# EAGLE design untitled (EAGLE 7.6.0)
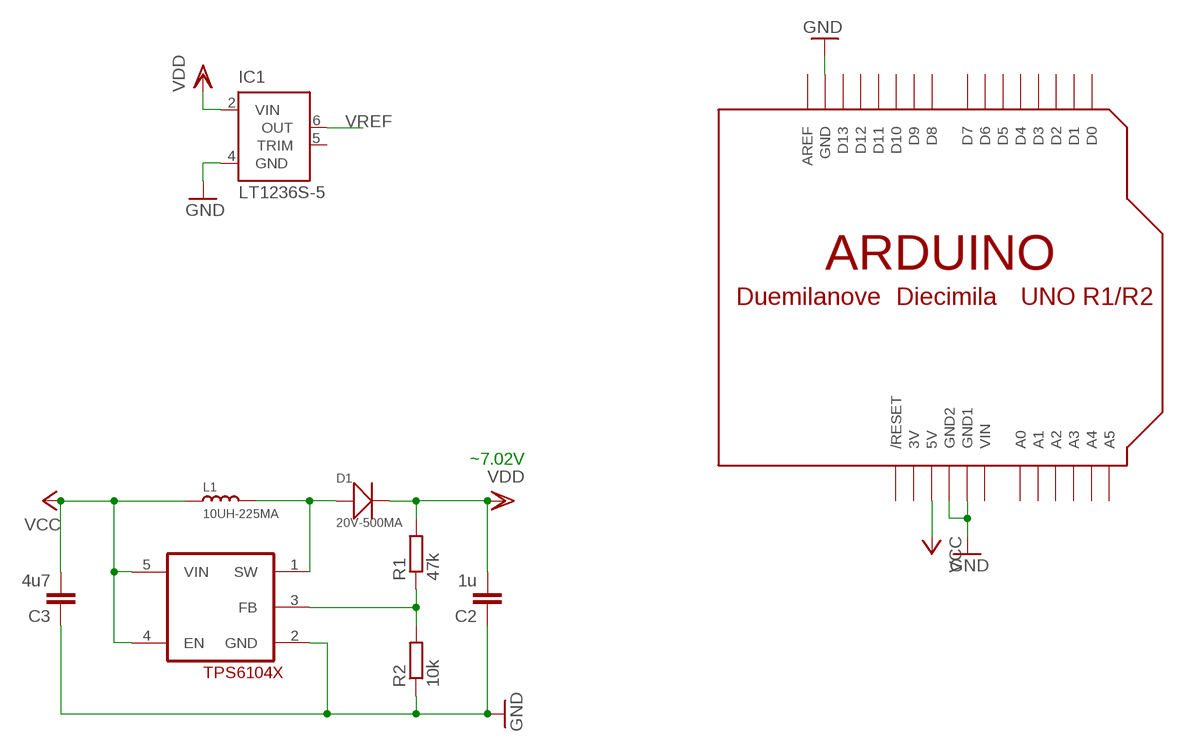
[diagram p0: schematic, sheet 1]

## Parts
C2  1u  C-EUC1206  [C1206]
C3  4u7  C-EUC1206  [C1206]
D1  20V-500MA  SMD-DIODE-SCHOTTKY-20V-500MA(SOD-123)P  [SOD-123]
IC1  LT1236S-5  [SOIC8]
L1  10UH-225MA  SMD-INDUCTOR-10UH-225MA-10%(0806)  [L0806]
R1  47k  R-EU_R0805  [R0805]
R2  10k  R-EU_R0805  [R0805]
U$1  ARDUINO-NOHOLE  [ARDUINO-NOHOLE]
U$2  TPS6104X  [SOT23-DBV]

## Nets
GND: C2.1 C3.1 IC1.4(GND) R2.1 U$1.GND U$1.GND1 U$1.GND2 U$2.2(GND)
N$1: D1.+ L1.2 U$2.1(SW)
N$5: R1.1 R2.2 U$2.3(FB)
VCC: C3.2 L1.1 U$1.5V U$2.4(EN) U$2.5(VIN)
VDD: C2.2 D1.- IC1.2(VIN) R1.2
VREF: IC1.6(OUT)
Unconnected: IC1.5(TRIM) U$1.A0 U$1.A1 U$1.A2 U$1.A3 U$1.A4 U$1.A5 U$1.AREF U$1.D0 U$1.D1 U$1.D2 U$1.D3 U$1.D4 U$1.D5 U$1.D6 U$1.D7 U$1.D8 U$1.D9 U$1.D10 U$1.D11 U$1.D12 U$1.D13 U$1.RESET(/RESET)

## Notes on the sheet
- ~7.02V

## Power pins joined to a net without a drawn wire
3V: U$1.3V
VIN: U$1.VIN

## Library data of the parts
C2 C3 = rcl:C-EU: CAPACITOR, European symbol
D1 = Seeed-Diode-2016:SMD-DIODE-SCHOTTKY-20V-500MA(SOD-123)P: 304020028; MPN: MBR0520LT1G
IC1 = linear-technology:LT1236?*: Precision Voltage Reference Source: http://www.linear.com/pc/downloadDocument.do?navId=H0,C1,C1154,C1002,C1243,P1156,D2948; OC_FARNELL: unknown; OC_NEWARK: unknown
L1 = Seeed-Inductor-2016:SMD-INDUCTOR-10UH-225MA-10%(0806): 303010042; MPN: LQH2MCN100K02L
R1 R2 = rcl:R-EU_: RESISTOR, European symbol
U$1 = adafruit:ARDUINO: Arduino Diecimila/Duemilanove Make a shield with ease, this package has all the named pins as well as the two mounting drill holes and an outline of the USB and DC power connector. The outline is on the DIMENSION layer, so if your board house uses it they will cut the outline to match. http://www.ladyada.net/library/pcb/eaglelibrary.html
U$2 = TPS6104:TPS6104X

## Board
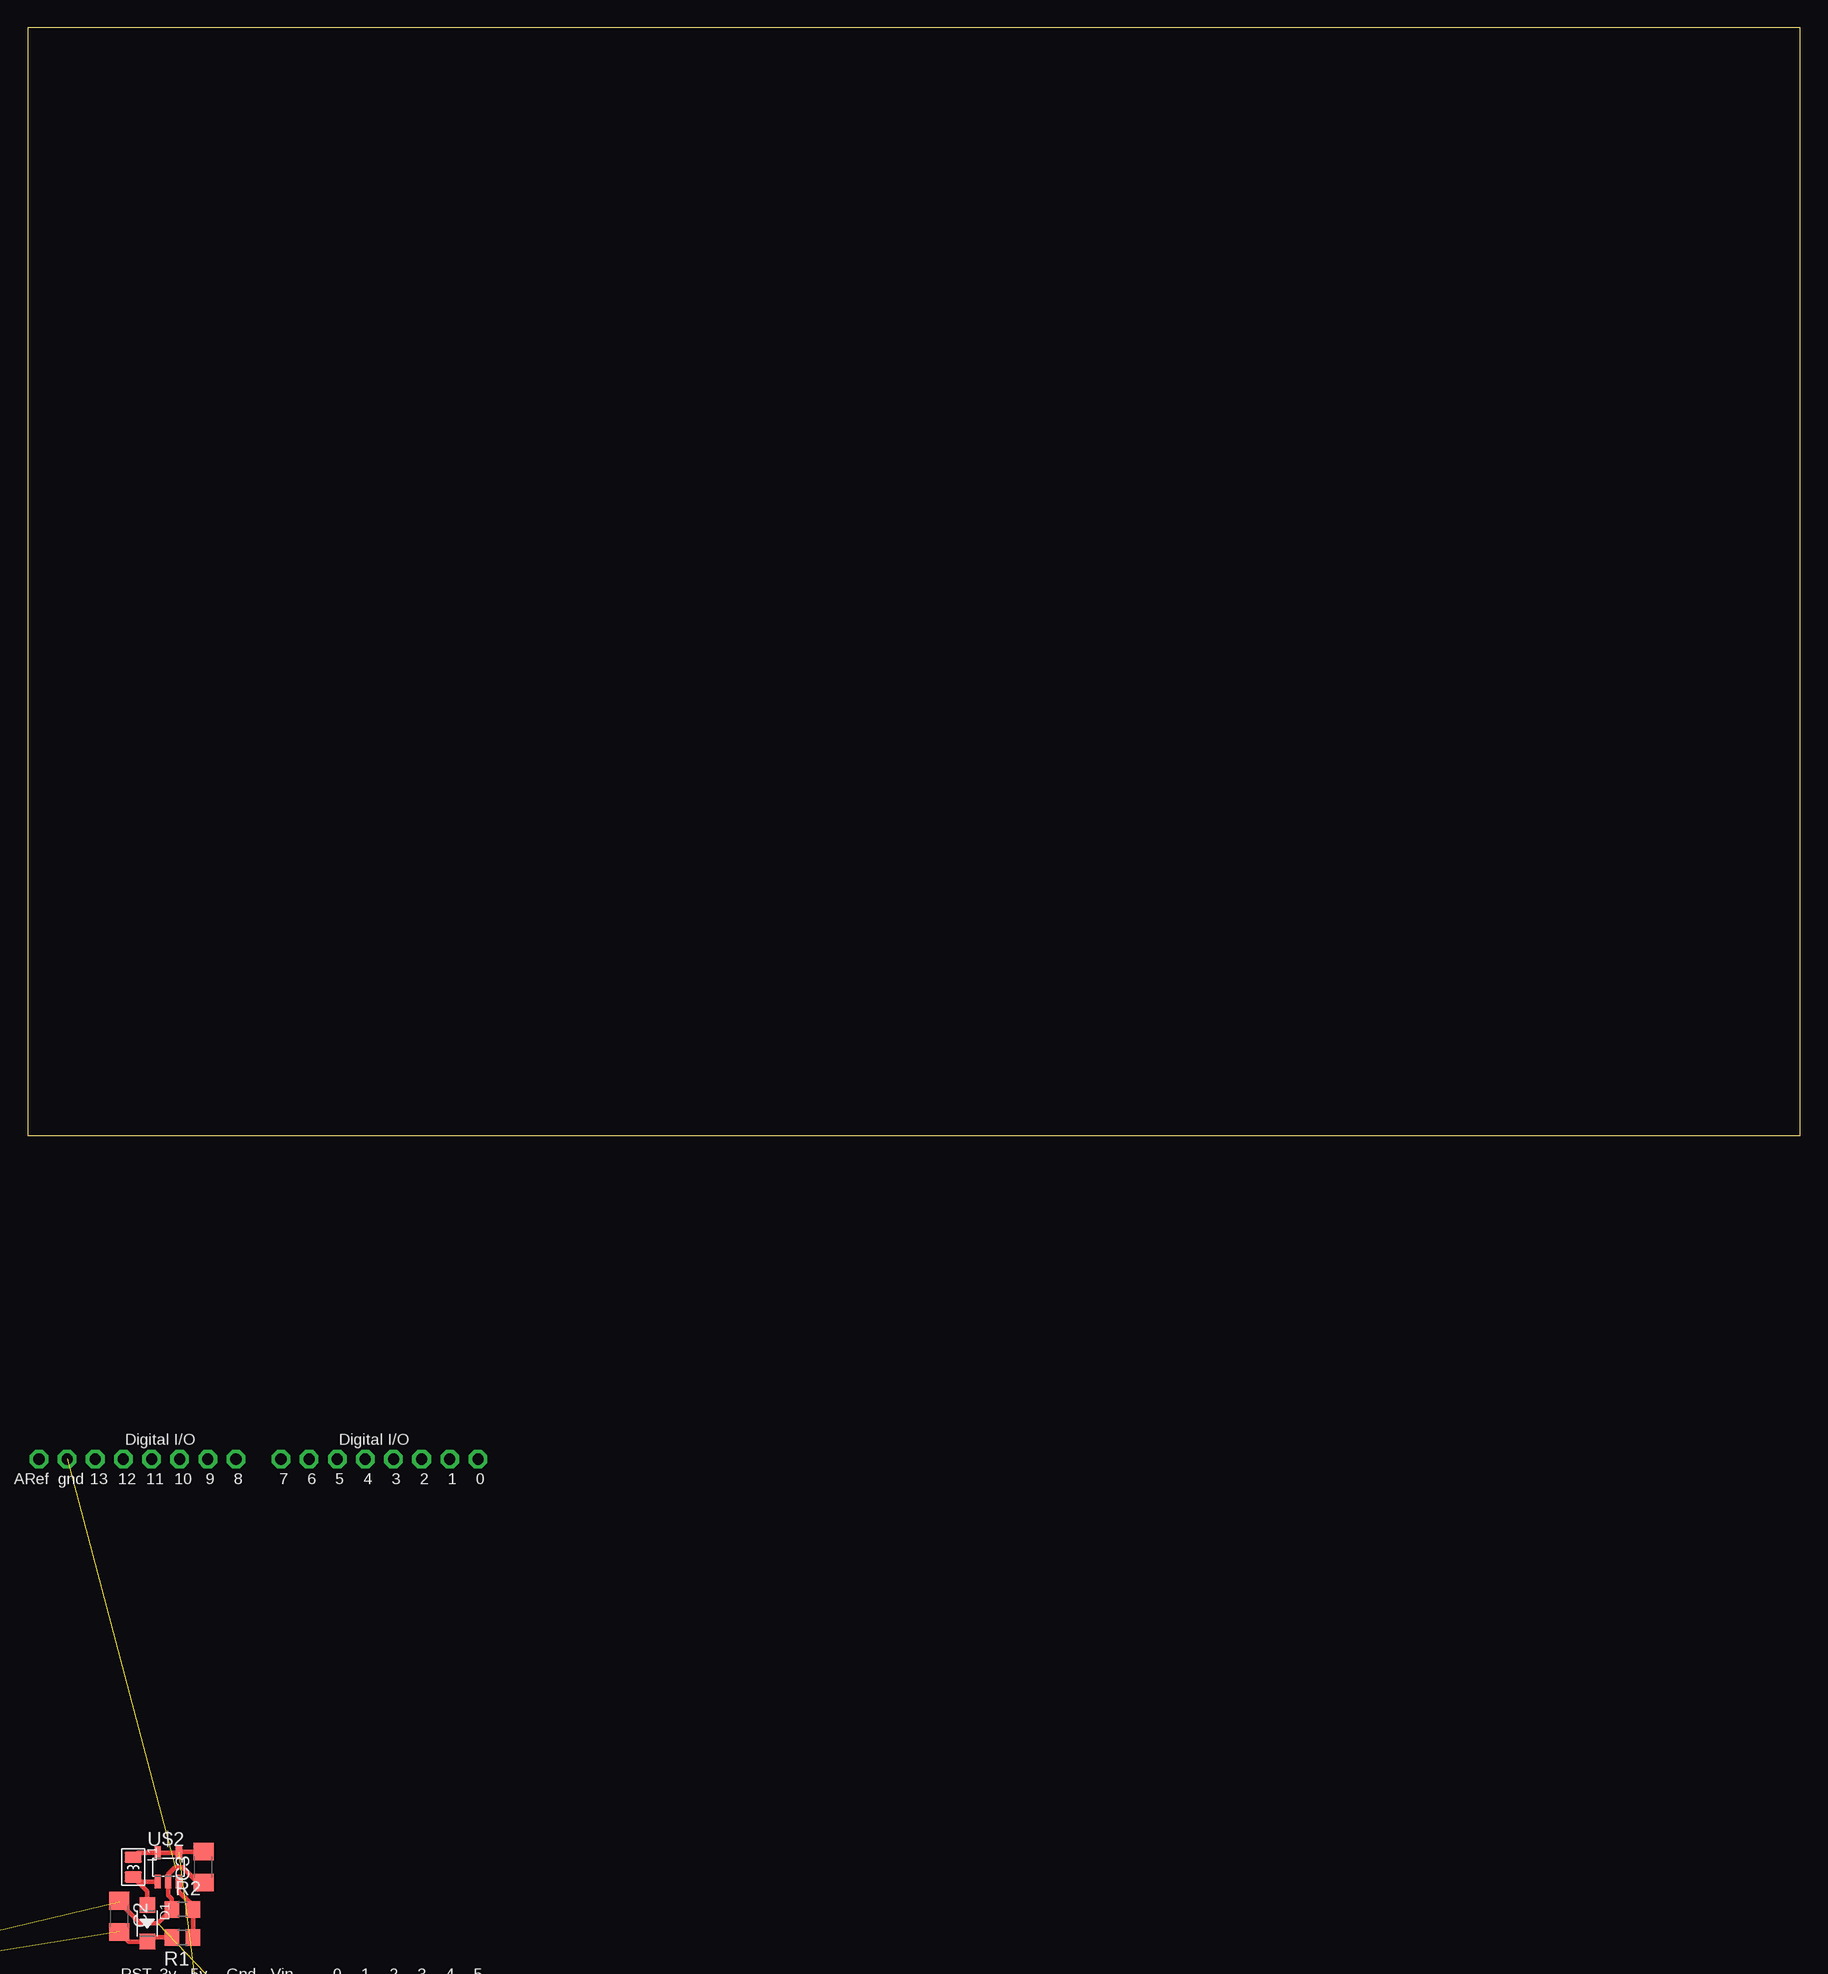
[diagram p1: board, top side]
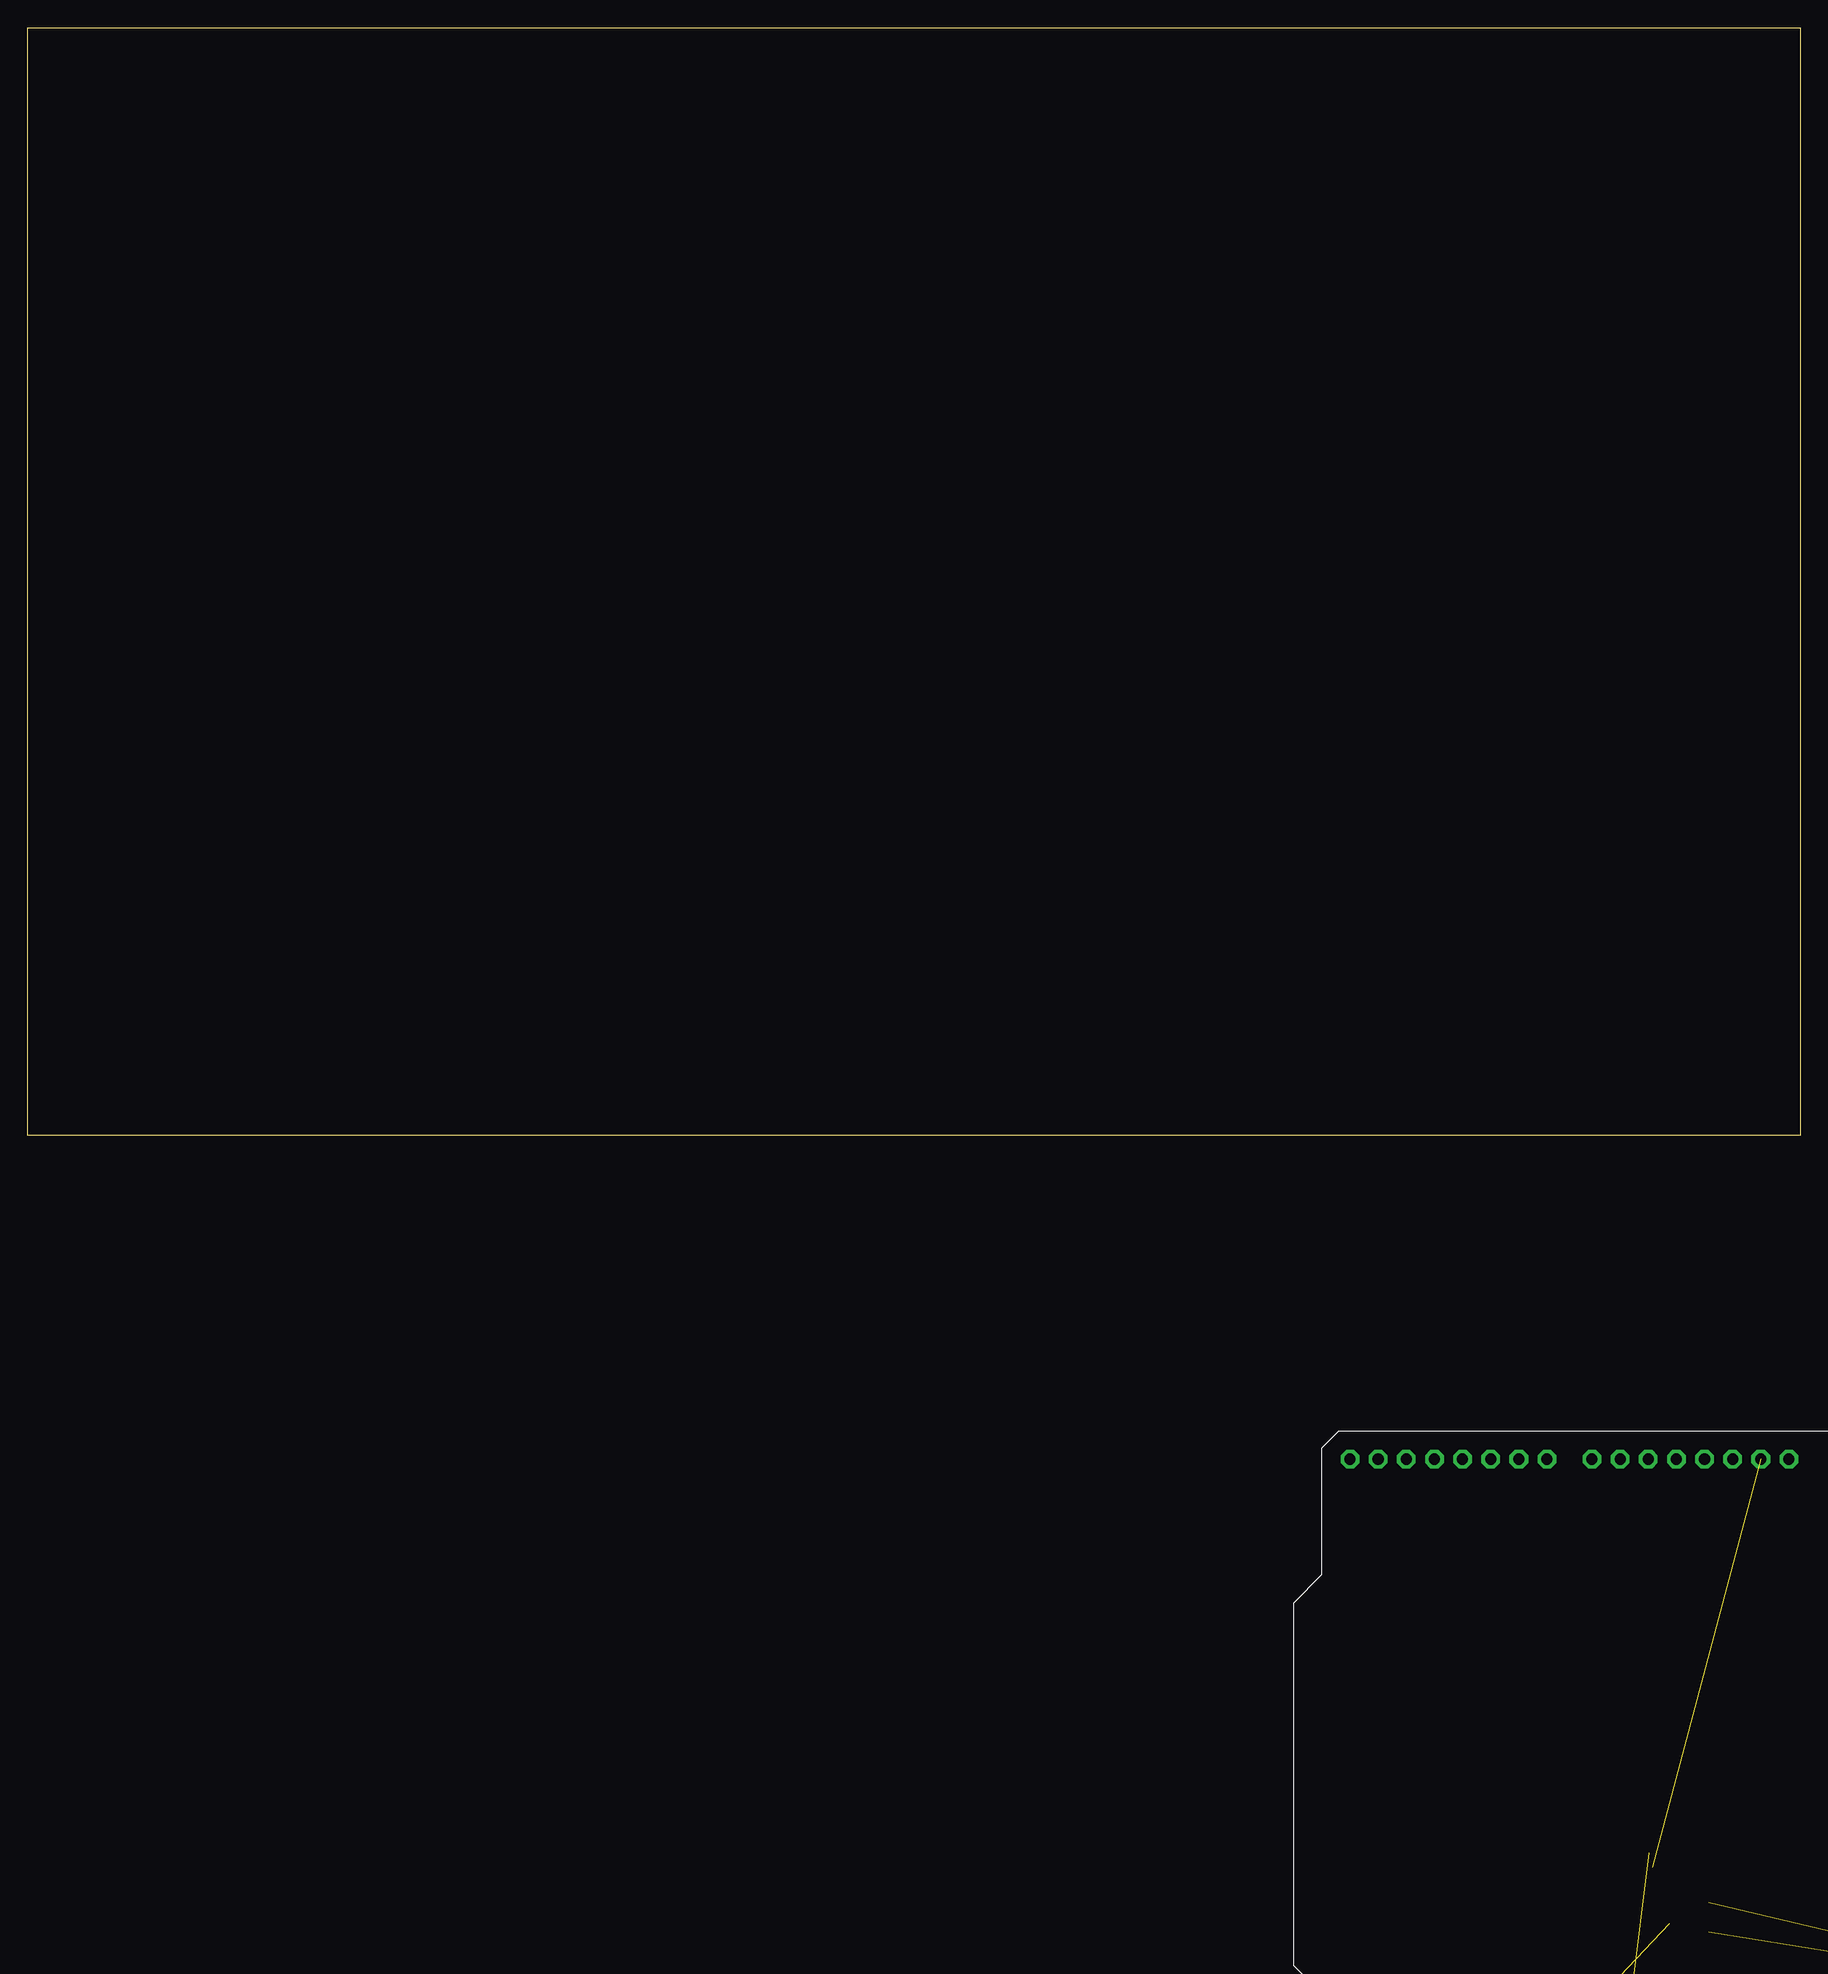
[diagram p2: board, bottom side, seen from below]

Size 160 x 100 mm. Coordinates in mm from the lower left corner, seen from the top.
Outline: 0,0 160,0 160,100 0,100 0,0
Copper layers (1*16): Top 0.035mm / dielectric 1.5mm / Bottom 0.035mm
Design rules "default": minimum track width 10mil, minimum drill 24mil, track to track 8mil, track to pad 8mil, pad to pad 8mil, via to via 8mil, smd to smd 8mil, copper to edge 40mil, drill to drill 8mil, minimum pad ring 10mil, minimum via ring 8mil, stop-mask expansion 4mil, vias tented up to drill 0mil, thermal gap 10mil

### Footprints (pad centres in the part's own frame; a part is rotated, then mirrored left to right if it is on the bottom)
C1206 = smd 1.6 x 1.8: 1 -1.4,0; 2 1.4,0
SOD-123 = smd 1.397 x 1.397: + -1.651,0; - 1.651,0
SOIC8 = smd 0.6 x 2.2: 1 -1.905,-2.6; 2 -0.635,-2.6; 3 0.635,-2.6; 4 1.905,-2.6; 5 1.905,2.6; 6 0.635,2.6; 7 -0.635,2.6; 8 -1.905,2.6
L0806 = smd 1.016 x 1.524: 1 -0.889,0; 2 0.889,0
R0805 = smd 1.3 x 1.5: 1 -0.95,0; 2 0.95,0
ARDUINO-NOHOLE = drill 1 pad 1.676 octagon: 3V 35.56,2.54; 5V 38.1,2.54; A0 50.8,2.54; A1 53.34,2.54; A2 55.88,2.54; A3 58.42,2.54; A4 60.96,2.54; A5 63.5,2.54; AREF 23.876,50.8; D0 63.5,50.8; D1 60.96,50.8; D2 58.42,50.8; D3 55.88,50.8; D4 53.34,50.8; D5 50.8,50.8; D6 48.26,50.8; D7 45.72,50.8; D8 41.656,50.8; D9 39.116,50.8; D10 36.576,50.8; D11 34.036,50.8; D12 31.496,50.8; D13 28.956,50.8; GND 26.416,50.8; GND1 43.18,2.54; GND2 40.64,2.54; RESET 33.02,2.54; VIN 45.72,2.54
SOT23-DBV = smd 0.55 x 1.2: 1 -0.95,-1.3; 2 0,-1.3; 3 0.95,-1.3; 4 0.95,1.3; 5 -0.95,1.3

### Placement (x,y rotation side)
C2  8.26,-70.48 270 top  (outside the outline)
C3  15.88,-66.04 90 top  (outside the outline)
D1  10.79,-71.12 270 top  (outside the outline)
IC1  -34.29,-76.2 0 top  (outside the outline)
L1  9.53,-66.04 270 top  (outside the outline)
R1  13.97,-72.39 180 top  (outside the outline)
R2  13.97,-69.85 0 top  (outside the outline)
U$1  -22.86,-80.01 0 top  (outside the outline)
U$2  12.7,-66.04 0 top  (outside the outline)

### Tracks (layer width: path | path; a pad name or v marks a point on that pad's centre or on a via)
GND  (4 unrouted)
  Top 0.406: C2.1 8.26,-69.22 10.16,-71.12 11.75,-71.12 R2.1 13.02,-68.9 12.7,-68.58 U$2.2 12.7,-66.67 13.34,-66.04 13.97,-66.04 15.37,-67.44 C3.1
N$1
  Top 0.406: D1.+ 10.79,-68.2 10.03,-67.44 | 10.03,-67.44 L1.2 | U$2.1 10.13,-67.34 10.03,-67.44
N$5
  Top 0.406: R1.1 R2.2 14.61,-69.53 14.61,-69.22 13.65,-68.26 U$2.3
VCC  (1 unrouted)
  Top 0.406: C3.2 13.65,-64.64 U$2.4 U$2.5 9.94,-64.74 L1.1
VDD  (1 unrouted)
  Top 0.406: R1.2 11.18,-72.39 D1.- 9.14,-72.77 C2.2